# Altium project dig_to_ea.PrjPCB
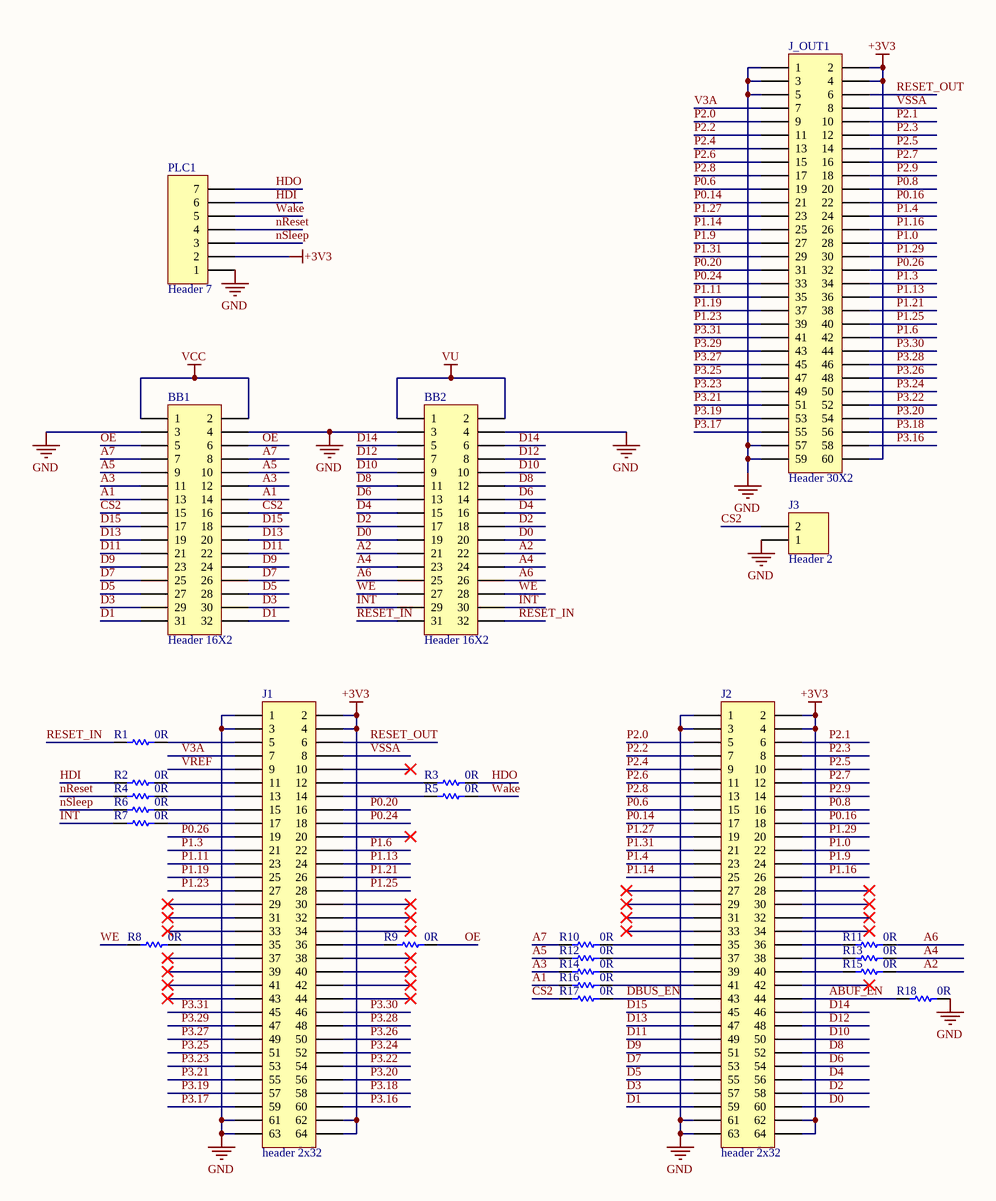
[diagram p0: top.SchDoc]
1 sheet, 25 parts. Net scope: global (net labels, ports and power ports of the same name join across sheets).
Board file: PCB0.1.PcbDoc

## Sheet top.SchDoc
size A3

### Parts
BB1  Header 16X2  [HDR2X16]
BB2  Header 16X2  [HDR2X16]
J1  header 2x32  [HDR2X32_special]
J2  header 2x32  [HDR2X32_special]
J3  Header 2  [HDR1X2]
J_OUT1  Header 30X2  [HDR2X30]
PLC1  Header 7  [HDR1X7]
R1  value 0R  [6-0805_L]  (hidden comment: Res1)
R2  value 0R  [6-0805_L]  (hidden comment: Res1)
R3  value 0R  [6-0805_L]  (hidden comment: Res1)
R4  value 0R  [6-0805_L]  (hidden comment: Res1)
R5  value 0R  [6-0805_L]  (hidden comment: Res1)
R6  value 0R  [6-0805_L]  (hidden comment: Res1)
R7  value 0R  [6-0805_L]  (hidden comment: Res1)
R8  value 0R  [6-0805_L]  (hidden comment: Res1)
R9  value 0R  [6-0805_L]  (hidden comment: Res1)
R10  value 0R  [6-0805_L]  (hidden comment: Res1)
R11  value 0R  [6-0805_L]  (hidden comment: Res1)
R12  value 0R  [6-0805_L]  (hidden comment: Res1)
R13  value 0R  [6-0805_L]  (hidden comment: Res1)
R14  value 0R  [6-0805_L]  (hidden comment: Res1)
R15  value 0R  [6-0805_L]  (hidden comment: Res1)
R16  value 0R  [6-0805_L]  (hidden comment: Res1)
R17  value 0R  [6-0805_L]  (hidden comment: Res1)
R18  value 0R  [6-0805_L]  (hidden comment: Res1)

### Nets
+3V3: J1.2 J1.4 J1.62 J1.64 J2.2 J2.4 J2.62 J2.64 J_OUT1.2 J_OUT1.4 J_OUT1.60 PLC1.2
GND: BB1.3 BB1.4 BB2.3 BB2.4 J1.1 J1.3 J1.61 J1.63 J2.1 J2.3 J2.61 J2.63 J3.1 J_OUT1.1 J_OUT1.3 J_OUT1.5 J_OUT1.57 J_OUT1.59 PLC1.1 R18.2
VCC: BB1.1 BB1.2
VU: BB2.1 BB2.2
A1: BB1.13 BB1.14 R16.1
A2: BB2.21 BB2.22 R15.2
A3: BB1.11 BB1.12 R14.1
A4: BB2.23 BB2.24 R13.2
A5: BB1.9 BB1.10 R12.1
A6: BB2.25 BB2.26 R11.2
A7: BB1.7 BB1.8 R10.1
ABUF_EN: J2.44 R18.1
CS2: BB1.15 BB1.16 J3.2 R17.1
D0: BB2.19 BB2.20 J2.60
D1: BB1.31 BB1.32 J2.59
D2: BB2.17 BB2.18 J2.58
D3: BB1.29 BB1.30 J2.57
D4: BB2.15 BB2.16 J2.56
D5: BB1.27 BB1.28 J2.55
D6: BB2.13 BB2.14 J2.54
D7: BB1.25 BB1.26 J2.53
D8: BB2.11 BB2.12 J2.52
D9: BB1.23 BB1.24 J2.51
D10: BB2.9 BB2.10 J2.50
D11: BB1.21 BB1.22 J2.49
D12: BB2.7 BB2.8 J2.48
D13: BB1.19 BB1.20 J2.47
D14: BB2.5 BB2.6 J2.46
D15: BB1.17 BB1.18 J2.45
DBUS_EN: J2.43 R17.2
HDI: PLC1.6 R2.1
HDO: PLC1.7 R3.2
INT: BB2.29 BB2.30 R7.1
nReset: PLC1.4 R4.1
nSleep: PLC1.3 R6.1
OE: BB1.5 BB1.6 R9.2
P0.6: J2.15 J_OUT1.19
P0.8: J2.16 J_OUT1.20
P0.14: J2.17 J_OUT1.21
P0.16: J2.18 J_OUT1.22
P0.20: J1.16 J_OUT1.31
P0.24: J1.18 J_OUT1.33
P0.26: J1.19 J_OUT1.32
P1.0: J2.22 J_OUT1.28
P1.3: J1.21 J_OUT1.34
P1.4: J2.23 J_OUT1.24
P1.6: J1.22 J_OUT1.42
P1.9: J2.24 J_OUT1.27
P1.11: J1.23 J_OUT1.35
P1.13: J1.24 J_OUT1.36
P1.14: J2.25 J_OUT1.25
P1.16: J2.26 J_OUT1.26
P1.19: J1.25 J_OUT1.37
P1.21: J1.26 J_OUT1.38
P1.23: J1.27 J_OUT1.39
P1.25: J1.28 J_OUT1.40
P1.27: J2.19 J_OUT1.23
P1.29: J2.20 J_OUT1.30
P1.31: J2.21 J_OUT1.29
P2.0: J2.5 J_OUT1.9
P2.1: J2.6 J_OUT1.10
P2.2: J2.7 J_OUT1.11
P2.3: J2.8 J_OUT1.12
P2.4: J2.9 J_OUT1.13
P2.5: J2.10 J_OUT1.14
P2.6: J2.11 J_OUT1.15
P2.7: J2.12 J_OUT1.16
P2.8: J2.13 J_OUT1.17
P2.9: J2.14 J_OUT1.18
P3.16: J1.60 J_OUT1.58
P3.17: J1.59 J_OUT1.55
P3.18: J1.58 J_OUT1.56
P3.19: J1.57 J_OUT1.53
P3.20: J1.56 J_OUT1.54
P3.21: J1.55 J_OUT1.51
P3.22: J1.54 J_OUT1.52
P3.23: J1.53 J_OUT1.49
P3.24: J1.52 J_OUT1.50
P3.25: J1.51 J_OUT1.47
P3.26: J1.50 J_OUT1.48
P3.27: J1.49 J_OUT1.45
P3.28: J1.48 J_OUT1.46
P3.29: J1.47 J_OUT1.43
P3.30: J1.46 J_OUT1.44
P3.31: J1.45 J_OUT1.41
RESET_IN: BB2.31 BB2.32 R1.1
RESET_OUT: J1.6 J_OUT1.6
V3A: J1.7 J_OUT1.7
VREF: J1.9
VSSA: J1.8 J_OUT1.8
Wake: PLC1.5 R5.2
WE: BB2.27 BB2.28 R8.1
NetJ1_5: J1.5 R1.2
NetJ1_11: J1.11 R2.2
NetJ1_12: J1.12 R3.1
NetJ1_13: J1.13 R4.2
NetJ1_14: J1.14 R5.1
NetJ1_15: J1.15 R6.2
NetJ1_17: J1.17 R7.2
NetJ1_35: J1.35 R8.2
NetJ1_36: J1.36 R9.1
NetJ2_35: J2.35 R10.2
NetJ2_36: J2.36 R11.1
NetJ2_37: J2.37 R12.2
NetJ2_38: J2.38 R13.1
NetJ2_39: J2.39 R14.2
NetJ2_40: J2.40 R15.1
NetJ2_41: J2.41 R16.2

Not connected (* = marked no-connect by the designer): J1 10* 20* 29* 30* 31* 32* 33* 34* 37* 38* 39* 40* 41* 42* 43* 44*; J2 27* 28* 29* 30* 31* 32* 33* 34* 42*

### Library data of the parts
BB1 BB2 = Header 16X2: Header, 16-Pin, Dual row; LatestRevisionDate: 17-Jul-2002; LatestRevisionNote: Re-released for DXP Platform.; Publisher: Altium Limited
J3 = Header 2: Header, 2-Pin; LatestRevisionDate: 17-Jul-2002; LatestRevisionNote: Re-released for DXP Platform.; Publisher: Altium Limited
J_OUT1 = Header 30X2: Header, 30-Pin, Dual row; LatestRevisionDate: 17-Jul-2002; LatestRevisionNote: Re-released for DXP Platform.; Publisher: Altium Limited
PLC1 = Header 7: Header, 7-Pin; LatestRevisionDate: 17-Jul-2002; LatestRevisionNote: Re-released for DXP Platform.; Publisher: Altium Limited
R1-R18 = Res1: Resistor; Published: 8-Jun-2000; LatestRevisionDate: 17-Jul-2002; LatestRevisionNote: Re-released for DXP Platform.; PackageReference: AXIAL-0.3; Publisher: Altium Limited; PackageDescription: Axial Device, Thru-Hole; 2 Leads; 0.3 in Pin Spacing